# Altium schematic sheet IsoInput.SchDoc
size A
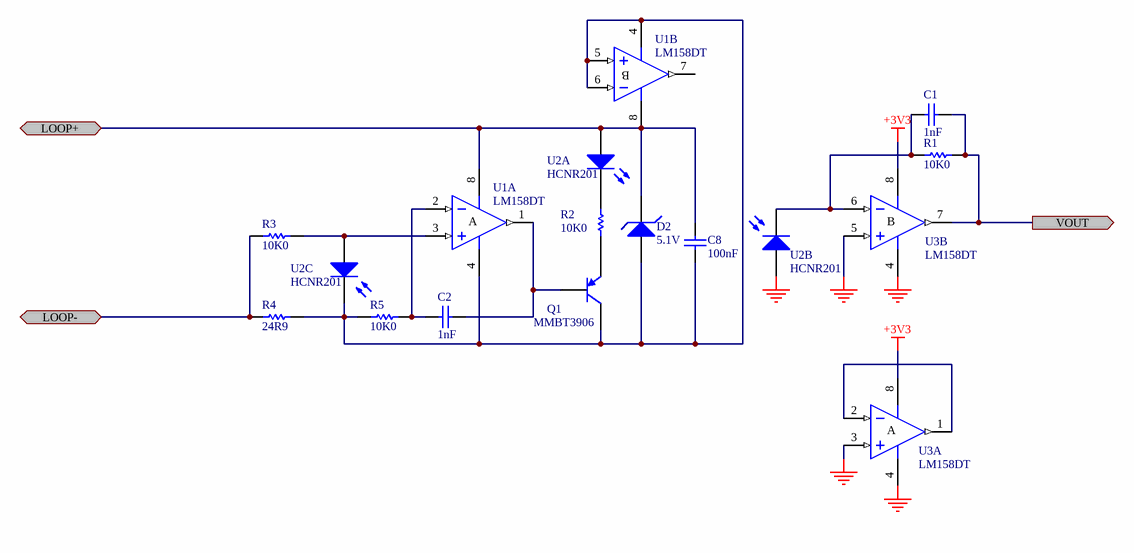
[diagram p0: IsoInput.SchDoc]

## Parts
C1  1nF  [CAPC0805(2012)100_L]
C2  1nF  [CAPC0805(2012)100_L]
C8  100nF  [CAPC0805(2012)100_L]
D2  5.1V  [DIOD-S1M-13-F-SMA-2_V]
Q1  MMBT3906  [SOT23_N]
R1  10K0  [RESC0805(2012)_L]
R2  10K0  [RESC0805(2012)_L]
R3  10K0  [RESC0805(2012)_L]
R4  24R9  [RESC0805(2012)_L]
R5  10K0  [RESC0805(2012)_L]
U1  LM158DT  [SO8_N]  (parts A,B of 2)
U2  HCNR201  [DIP-8W]  (parts A,B,C of 3)
U3  LM158DT  [SO8_N]  (parts A,B of 2)

## Ports
LOOP+ (bidir), LOOP- (bidir), VOUT (out)

## Nets
+3V3: U3.8(V+)
GND: U2.4(PD1A) U3.3(IN+) U3.4(V-) U3.5(IN+)
LOOP+: C8.2 D2.2(K) U1.8(V+) U2.2(A) ; port LOOP+
LOOP-: R3.2 R4.1 ; port LOOP-
VOUT: C1.2 R1.1 U3.7(OUT) ; port VOUT
NetC1_1: C1.1 R1.2 U2.3(PD1K) U3.6(IN-)
NetC2_1: C2.1 R5.1 U1.2(IN-)
NetC2_2: C2.2 Q1.1(B) U1.1(OUT)
NetC8_1: C8.1 D2.1(A) Q1.3(C) R4.2 R5.2 U1.4(V-) U1.5(IN+) U1.6(IN-) U2.6(PD2K)
NetQ1_2: Q1.2(E) R2.1
NetR2_2: R2.2 U2.1(K)
NetR3_1: R3.1 U1.3(IN+) U2.5(PD2A)
NetU3_1: U3.1(OUT) U3.2(IN-)

Not connected (* = marked no-connect by the designer): U1 7(OUT)

## Notes on the sheet
- (in symbol LM158AD, part A) A
- (in symbol LM158AD, part B) B

## Library data of the parts
C1 C2 = CMP-1036-02980-1: CAP 1nF 50V ±10% 0805 (2012 Metric) Thickness 1mm SMD; Case-Metric: 2012; Case-EIA: 0805; Value: 1nF; Technology: SMT; Tolerance: ±10%; Max Thickness: 1 mm; Rated Voltage: 50 V; Supplier 1: Digi-Key; Supplier Part Number 1: 399-1147-1-ND
C8 = CMP-1036-04420-1: CAP 100nF 50V ±10% 0805 (2012 Metric) Thickness 1mm SMD; Case-EIA: 0805; Case-Metric: 2012; Rated Voltage: 50 V; Value: 100nF; Tolerance: ±10%; Max Thickness: 1 mm; Technology: SMT; Supplier 1: Digi-Key; Supplier Part Number 1: 399-1170-1-ND
D2 = CMP-0639-00001-1: Surface Mount Glass Passivated Rectifier, 1000V, 1 A, -65 to 5.1V Zener Diode SMA; Manufacturer: Diodes Inc; PartNumber: S1M-13-F; Maximum Reverse Current IR (uA): 5; Maximum Peak Forward Surge Current IFSM (A): 30; Maximum Average Rectified Current IO (A): 1; Peak Repetitive Reverse Voltage VRRM (V): 1000; Total Capacitance CT (pF): 10; Forward Voltage Drop VF (V): 1.1; Packing: Tape and Reel; ComponentLink1URL: http://www.diodes.com/; Operating Temperature Range: -65 to 150 degC; ComponentLink3URL: http://diodes.com/datasheets/ds16003.pdf; ComponentLink3Description: Package Specification; PackageDescription: 2-Pin SMD, Body 4.3 x 2.605 mm, Height 2.3 mm; Mounting Technology: Surface Mount; ComponentLink1Description: Manufacturer URL; PackageReference: S1M-13-F-SMA-2; ComponentLink2URL: http://diodes.com/datasheets/ds16003.pdf; ComponentLink2Description: Datasheet; RoHS: TRUE; DatasheetVersion: Rev. 22 - 2; PackageVersion: Rev. 22 - 2; Supplier 1: Digi-Key; Supplier Part Number 1: SMAZ5V1-TPMSCT-ND
Q1 = MMBT3906: PNP Switching Transistor; Published: 17-Sep-2003; LatestRevisionDate: 12-Dec-2006; LatestRevisionNote: IPC-7351 Footprint Added.; DatasheetVersion: 11-Apr-2000; PackageVersion: May-1999; PackageReference: SOT23; Publisher: Altium Limited; PackageDescription: 3-Pin SOT-23 Package 0.95 mm Pitch, 2.3 mm Lead Span; ComponentLink1Description: Manufacturer Link; ComponentLink1URL: http://www.semiconductors.philips.com/; ComponentLink2Description: Datasheet; ComponentLink2URL: http://www.semiconductors.philips.com/acrobat/datasheets/MMBT3906_2.pdf; Supplier 1: Digi-Key; Supplier Part Number 1: MMBT3906-FDICT-ND
R1-R3 R5 = CMP-1013-00623-1: 10K 0.125W 1% 0805 (2012 Metric)  SMD; Case-Metric: 2012; Case-EIA: 0805; Value: 10K0; Tolerance: 1 %; Power: 0.125 W; Technology: SMT; Supplier 1: Digi-Key; Supplier Part Number 1: RMCF0805FT10K0CT-ND
R4 = CMP-1013-00327-1: 24R9 0.125W 1% 0805 (2012 Metric)  SMD; Case-Metric: 2012; Case-EIA: 0805; Power: 0.125 W; Technology: SMT; Tolerance: 1 %; Value: 24R9; Supplier 1: Digi-Key; Supplier Part Number 1: RHM24.9CHCT-ND
U1 U3 = LM158AD: Low-Power Dual Operational Amplifier; Published: 24-Aug-2001; LatestRevisionDate: 13-Apr-2006; LatestRevisionNote: IPC-7351 Footprint Added.; DatasheetVersion: Jun-1998; PackageVersion: Dec-2002; PackageReference: SO8; Publisher: Altium Limited; PackageDescription: 8-Pin Small Outline Integrated Circuit 1.27 mm Pitch; Code_JEDEC: MS-012-AA; Code_IPC: SOIC127P600-8; ComponentLink1Description: Manufacturer Link; ComponentLink1URL: http://www.st.com/; ComponentLink2Description: Datasheet; ComponentLink2URL: http://www.st.com/stonline/products/literature/ds/2163/lm358.pdf; Supplier 1: Digi-Key; Supplier Part Number 1: 497-6990-1-ND
U2 = HCNR201: Analog Optocoupler; Supplier 1: Digi-Key; Supplier Part Number 1: 516-1523-5-ND